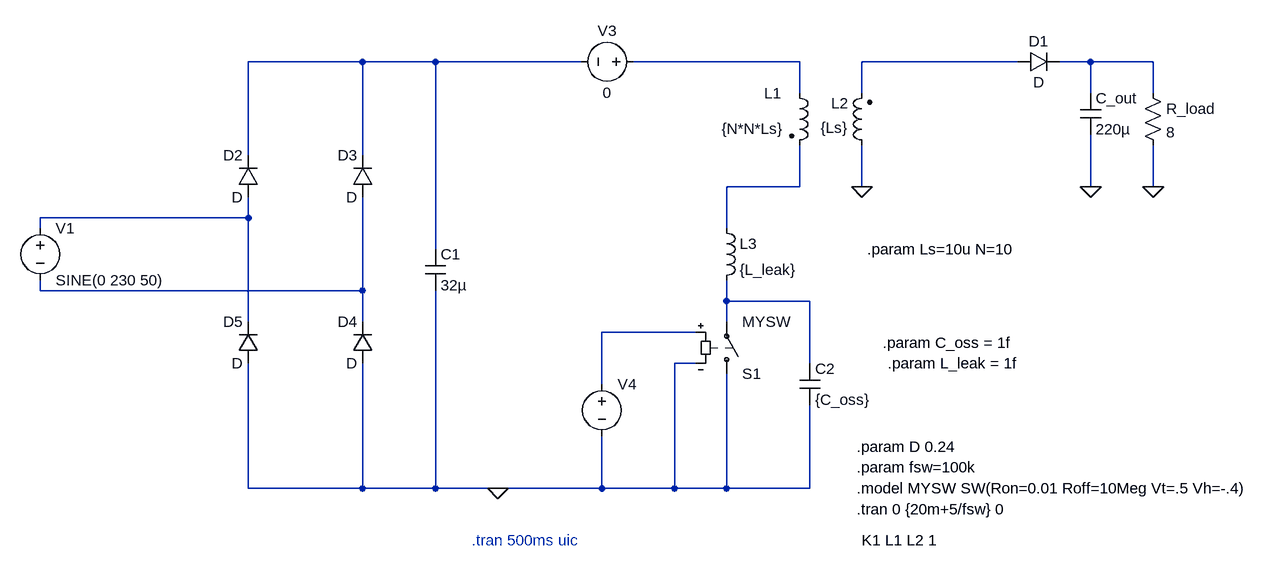
[diagram p0: schematic flyback.asc]
flyback.asc, the LTspice schematic file:
Version 4
SHEET 1 2276 688
WIRE -144 -64 -320 -64
WIRE -32 -64 -144 -64
WIRE 192 -64 -32 -64
WIRE 528 -64 272 -64
WIRE 864 -64 624 -64
WIRE 976 -64 928 -64
WIRE 1072 -64 976 -64
WIRE 528 -16 528 -64
WIRE 624 -16 624 -64
WIRE 976 -16 976 -64
WIRE 1072 -16 1072 -64
WIRE -320 80 -320 -64
WIRE -144 80 -144 -64
WIRE 528 128 528 64
WIRE 528 128 416 128
WIRE 624 128 624 64
WIRE 976 128 976 48
WIRE 1072 128 1072 64
WIRE -320 176 -320 144
WIRE -320 176 -640 176
WIRE -640 192 -640 176
WIRE 416 192 416 128
WIRE -32 224 -32 -64
WIRE -640 288 -640 272
WIRE -144 288 -144 144
WIRE -144 288 -640 288
WIRE 416 304 416 272
WIRE 544 304 416 304
WIRE -320 336 -320 176
WIRE -144 336 -144 288
WIRE 416 336 416 304
WIRE 368 352 224 352
WIRE 368 400 336 400
WIRE 544 400 544 304
WIRE 224 432 224 352
WIRE -320 592 -320 400
WIRE -144 592 -144 400
WIRE -144 592 -320 592
WIRE -32 592 -32 288
WIRE -32 592 -144 592
WIRE 64 592 -32 592
WIRE 224 592 224 512
WIRE 224 592 64 592
WIRE 336 592 336 400
WIRE 336 592 224 592
WIRE 416 592 416 416
WIRE 416 592 336 592
WIRE 544 592 544 464
WIRE 544 592 416 592
FLAG 64 592 0
FLAG 624 128 0
FLAG 1072 128 0
FLAG 976 128 0
SYMBOL cap 960 -16 R0
SYMATTR InstName C_out
SYMATTR Value 220µ
SYMBOL res 1056 -32 R0
SYMATTR InstName R_load
SYMATTR Value 8
SYMBOL diode -304 144 R180
WINDOW 0 24 64 Left 2
WINDOW 3 24 0 Left 2
SYMATTR InstName D2
SYMBOL diode -128 144 R180
WINDOW 0 24 64 Left 2
WINDOW 3 24 0 Left 2
SYMATTR InstName D3
SYMBOL diode -128 400 R180
WINDOW 0 24 64 Left 2
WINDOW 3 24 0 Left 2
SYMATTR InstName D4
SYMBOL diode -304 400 R180
WINDOW 0 24 64 Left 2
WINDOW 3 24 0 Left 2
SYMATTR InstName D5
SYMBOL cap -48 224 R0
SYMATTR InstName C1
SYMATTR Value 32µ
SYMBOL voltage -640 176 R0
WINDOW 123 0 0 Left 0
WINDOW 39 0 0 Left 0
SYMATTR InstName V1
SYMATTR Value SINE(0 230 50)
SYMBOL voltage 288 -64 R90
WINDOW 0 -32 56 VBottom 2
WINDOW 3 32 56 VTop 2
WINDOW 123 0 0 Left 0
WINDOW 39 0 0 Left 0
SYMATTR InstName V3
SYMATTR Value 0
SYMBOL sw 416 432 M180
SYMATTR InstName S1
SYMATTR Value MYSW
SYMBOL diode 864 -48 R270
WINDOW 0 32 32 VTop 2
WINDOW 3 0 32 VBottom 2
SYMATTR InstName D1
SYMBOL ind2 512 -32 R0
WINDOW 0 -38 16 Left 2
WINDOW 3 -104 71 Left 2
SYMATTR InstName L1
SYMATTR Value {N*N*Ls}
SYMATTR Type ind
SYMBOL ind2 640 80 R180
WINDOW 0 36 80 Left 2
WINDOW 3 37 43 Left 2
SYMATTR InstName L2
SYMATTR Value {Ls}
SYMATTR Type ind
SYMBOL voltage 224 416 R0
WINDOW 3 24 96 Invisible 2
WINDOW 123 0 0 Left 0
WINDOW 39 0 0 Left 0
SYMATTR Value PULSE(0 1 0 10n 10n {D/fsw} {1/fsw})
SYMATTR InstName V4
SYMBOL ind 400 176 R0
SYMATTR InstName L3
SYMATTR Value {L_leak}
SYMBOL cap 528 400 R0
SYMATTR InstName C2
SYMATTR Value {C_oss}
TEXT 24 672 Left 2 ;.tran 500ms uic
TEXT 632 224 Left 2 !.param Ls=10u N=10
TEXT 616 592 Left 2 !.model MYSW SW(Ron=0.01 Roff=10Meg Vt=.5 Vh=-.4)
TEXT 624 672 Left 2 !K1 L1 L2 1
TEXT 616 560 Left 2 !.param fsw=100k
TEXT 616 528 Left 2 !.param D 0.24
TEXT 616 624 Left 2 !.tran 0 {20m+5/fsw} 0
TEXT 656 368 Left 2 !.param C_oss = 1f
TEXT 664 400 Left 2 !.param L_leak = 1f

The netlist it stands for:
* flyback.asc
C_out N004 0 220µ
R_load N004 0 8
D2 N006 N001 D
D3 N007 N001 D
D4 0 N007 D
D5 0 N006 D
C1 N001 0 32µ
V1 N006 N007 SINE(0 230 50)
V3 N002 N001 0
S1 0 N008 N009 0 MYSW
D1 N003 N004 D
L1 N002 N005 {N*N*Ls}
L2 0 N003 {Ls}
V4 N009 0 PULSE(0 1 0 10n 10n {D/fsw} {1/fsw})
L3 N005 N008 {L_leak}
C2 N008 0 {C_oss}
.model D D
.lib standard.dio
* .tran 500ms uic
.param Ls=10u N=10
.model MYSW SW(Ron=0.01 Roff=10Meg Vt=.5 Vh=-.4)
K1 L1 L2 1
.param fsw=100k
.param D 0.24
.tran 0 {20m+5/fsw} 0
.param C_oss = 1f
.param L_leak = 1f
.backanno
.end